# Altium project Voltage_Meter.PrjPCB
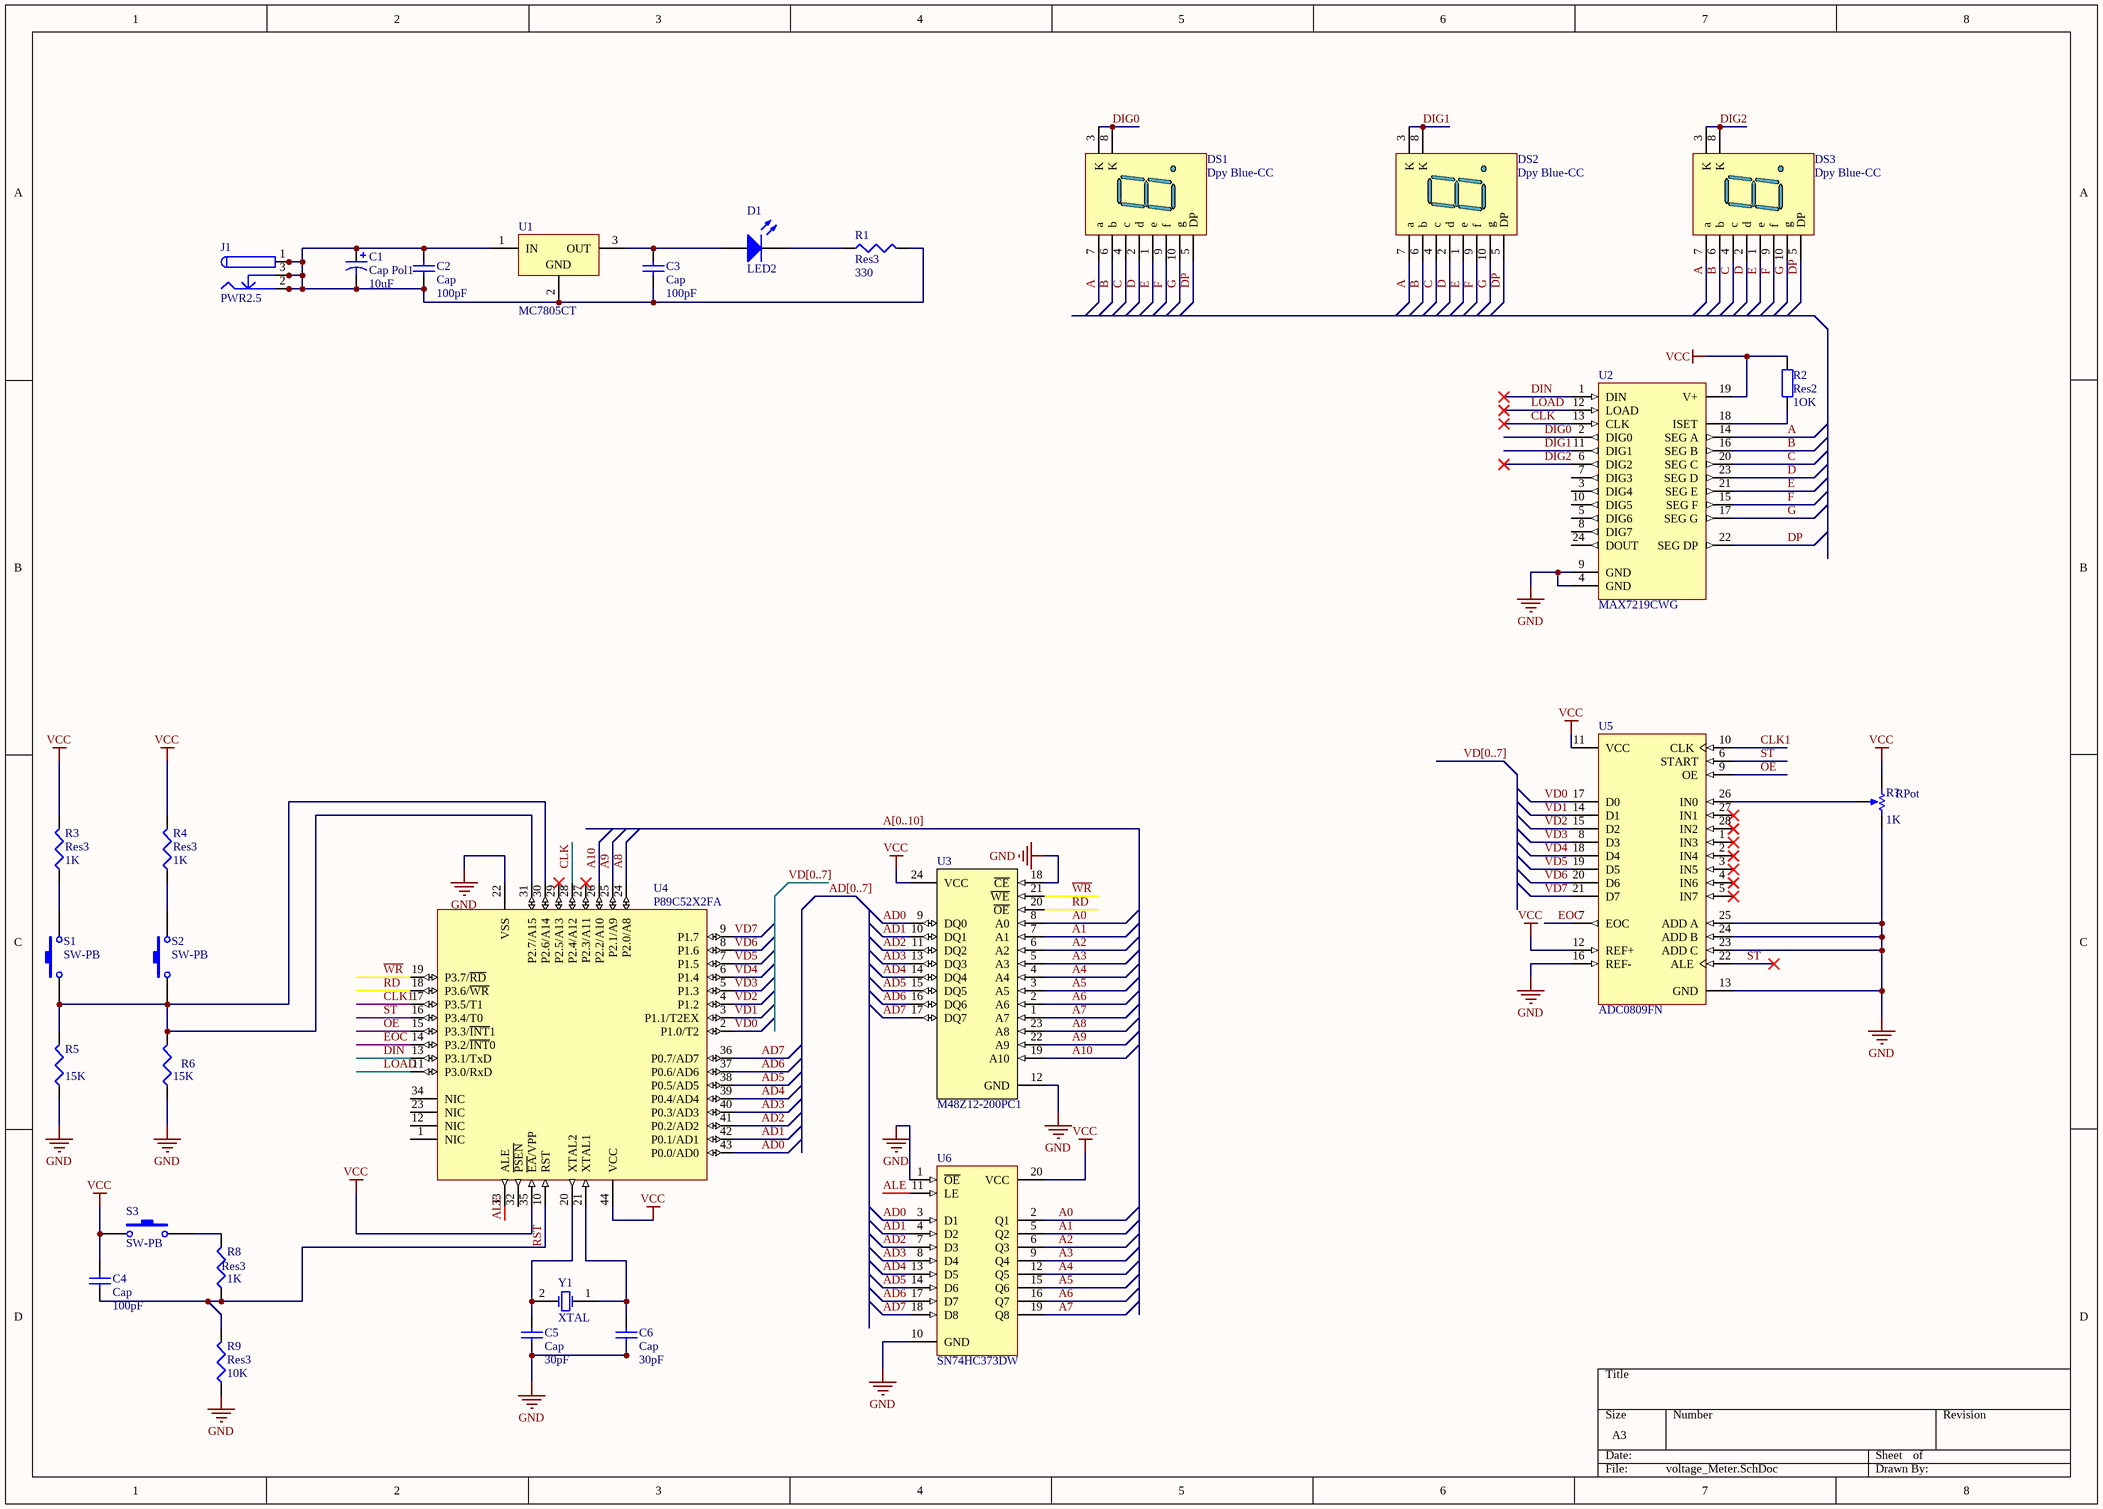
[diagram p0: voltage_Meter.SchDoc]
1 sheet, 30 parts. Net scope: global (net labels, ports and power ports of the same name join across sheets).

## Sheet voltage_Meter.SchDoc
size A3

### Parts
C1  Cap Pol1  value 10uF  [RB7.6-15]
C2  Cap  value 100pF  [RAD-0.3]
C3  Cap  value 100pF  [RAD-0.3]
C4  Cap  value 100pF  [RAD-0.3]
C5  Cap  value 30pF  [RAD-0.3]
C6  Cap  value 30pF  [RAD-0.3]
D1  LED2  [3.2X1.6X1.1]
DS1  Dpy Blue-CC  [H]
DS2  Dpy Blue-CC  [H]
DS3  Dpy Blue-CC  [H]
J1  PWR2.5  [KLD-0202]
R1  Res3  value 330  [J1-0603]
R2  Res2  value 1OK  [AXIAL-0.4]
R3  Res3  value 1K  [J1-0603]
R4  Res3  value 1K  [J1-0603]
R5  value 15K  [J1-0603]
R6  value 15K  [J1-0603]
R8  Res3  value 1K  [J1-0603]
R9  Res3  value 10K  [J1-0603]
R?  RPot  value 1K  [VR5]
S1  SW-PB  [SPST-2]
S2  SW-PB  [SPST-2]
S3  SW-PB  [SPST-2]
U1  MC7805CT  [221A-04]
U2  MAX7219CWG  [WSO24_N]
U3  M48Z12-200PC1  [PCDIP24]
U4  P89C52X2FA  [SOT187-2_N]
U5  ADC0809FN  [FN028_N]
U6  SN74HC373DW  [DW020_N]
Y1  XTAL  [R38]

### Nets
GND: C5.1 C6.1 R5.1 R6.1 R9.1 R?.2(BOT) U2.4(GND) U2.9(GND) U3.12(GND) U3.18(~{CE}) U4.22(VSS) U5.13(GND) U5.16(REF-) U5.23(ADD_C) U5.24(ADD_B) U5.25(ADD_A) U6.1(~{OE}) U6.10(GND)
VCC: C4.2 R2.2 R3.2 R4.2 R?.1(TOP) S3.1 U2.19(V+) U3.24(VCC) U4.35(~{EA}/VPP) U4.44(VCC) U5.11(VCC) U5.12(REF+) U6.20(VCC)
A: DS1.7(a) DS2.7(a) DS3.7(a) U2.14(SEG_A)
A0: U3.8(A0) U6.2(Q1)
A1: U3.7(A1) U6.5(Q2)
A2: U3.6(A2) U6.6(Q3)
A3: U3.5(A3) U6.9(Q4)
A4: U3.4(A4) U6.12(Q5)
A5: U3.3(A5) U6.15(Q6)
A6: U3.2(A6) U6.16(Q7)
A7: U3.1(A7) U6.19(Q8)
A8: U3.23(A8) U4.24(P2.0/A8)
A9: U3.22(A9) U4.25(P2.1/A9)
A10: U3.19(A10) U4.26(P2.2/A10)
AD0: U3.9(DQ0) U4.43(P0.0/AD0) U6.3(D1)
AD1: U3.10(DQ1) U4.42(P0.1/AD1) U6.4(D2)
AD2: U3.11(DQ2) U4.41(P0.2/AD2) U6.7(D3)
AD3: U3.13(DQ3) U4.40(P0.3/AD3) U6.8(D4)
AD4: U3.14(DQ4) U4.39(P0.4/AD4) U6.13(D5)
AD5: U3.15(DQ5) U4.38(P0.5/AD5) U6.14(D6)
AD6: U3.16(DQ6) U4.37(P0.6/AD6) U6.17(D7)
AD7: U3.17(DQ7) U4.36(P0.7/AD7) U6.18(D8)
ALE: U4.33(ALE) U6.11(LE)
B: DS1.6(b) DS2.6(b) DS3.6(b) U2.16(SEG_B)
C: DS1.4(c) DS2.4(c) DS3.4(c) U2.20(SEG_C)
CLK: U2.13(CLK) U4.28(P2.4/A12)
CLK1: U4.17(P3.5/T1) U5.10(CLK)
D: DS1.2(d) DS2.2(d) DS3.2(d) U2.23(SEG_D)
DIG0: DS1.3(K) DS1.8(K) U2.2(DIG0)
DIG1: DS2.3(K) DS2.8(K) U2.11(DIG1)
DIG2: DS3.3(K) DS3.8(K) U2.6(DIG2)
DIN: U2.1(DIN) U4.13(P3.1/TxD)
DP: DS1.5(DP) DS2.5(DP) DS3.5(DP) U2.22(SEG_DP)
E: DS1.1(e) DS2.1(e) DS3.1(e) U2.21(SEG_E)
EOC: U4.14(P3.2/~{INT}0) U5.7(EOC)
F: DS1.9(f) DS2.9(f) DS3.9(f) U2.15(SEG_F)
G: DS1.10(g) DS2.10(g) DS3.10(g) U2.17(SEG_G)
LOAD: U2.12(LOAD) U4.11(P3.0/RxD)
OE: U4.15(P3.3/~{INT}1) U5.9(OE)
RD: U3.20(~{OE}) U4.18(P3.6/~{WR})
RST: C4.1 R8.1 R9.2 U4.10(RST)
ST: U4.16(P3.4/T0) U5.6(START) U5.22(ALE)
VD0: U4.2(P1.0/T2) U5.17(D0)
VD1: U4.3(P1.1/T2EX) U5.14(D1)
VD2: U4.4(P1.2) U5.15(D2)
VD3: U4.5(P1.3) U5.8(D3)
VD4: U4.6(P1.4) U5.18(D4)
VD5: U4.7(P1.5) U5.19(D5)
VD6: U4.8(P1.6) U5.20(D6)
VD7: U4.9(P1.7) U5.21(D7)
~{WR}: U3.21(~{WE}) U4.19(P3.7/~{RD})
NetC1_1: C1.1 C1.2 C2.1 C2.2 C3.1 J1.1 J1.1A J1.1B J1.2 J1.2A J1.2B J1.3 J1.3A J1.3B R1.2 U1.1(IN) U1.2(GND)
NetC3_2: C3.2 D1.1(A) U1.3(OUT)
NetC5_2: C5.2 U4.20(XTAL2) Y1.2(OSC2)
NetC6_2: C6.2 U4.21(XTAL1) Y1.1(OSC1)
NetD1_2: D1.2(K) R1.1
NetR2_1: R2.1 U2.18(ISET)
NetR3_1: R3.1 S1.2
NetR4_1: R4.1 S2.2
NetR5_2: R5.2 R6.2 S1.1 S2.1 U4.30(P2.6/A14) U4.31(P2.7/A15)
NetR8_2: R8.2 S3.2
NetR?_3: R?.3(TAP) U5.26(IN0)

Not connected (* = marked no-connect by the designer): U2 3(DIG4) 5(DIG6) 7(DIG3) 8(DIG7) 10(DIG5) 24(DOUT); U4 1(NIC) 12(NIC) 23(NIC) 27(P2.3/A11)* 29(P2.5/A13)* 32(~{PSEN}) 34(NIC); U5 1(IN3)* 2(IN4)* 3(IN5)* 4(IN6)* 5(IN7)* 27(IN1)* 28(IN2)*

### Buses and harness runs
bus A[0..10]
bus AD[0..7]
bus VD[0..7]

### Library data of the parts
C1 = Cap Pol1: Polarized Capacitor (Radial); Published: 8-Jun-2000; LatestRevisionDate: 17-Jul-2002; LatestRevisionNote: Re-released for DXP Platform.; PackageReference: RB7.6-15; Publisher: Altium Limited; PackageDescription: Polarized Capacitor (Radial); 2 Leads
C2-C6 = Cap: Capacitor; Published: 8-Jun-2000; LatestRevisionDate: 17-Jul-2002; LatestRevisionNote: Re-released for DXP Platform.; PackageReference: RAD-0.3; Publisher: Altium Limited; PackageDescription: Radial Cap, Thru-Hole; 2 Leads; 0.3 in Pin Spacing
D1 = LED2: Typical RED, GREEN, YELLOW, AMBER GaAs LED; Published: 8-Jun-2000; LatestRevisionDate: 17-Jul-2002; LatestRevisionNote: Re-released for DXP Platform.; PackageVersion: Feb-2002; PackageReference: 3.2X1.6X1.1; Publisher: Altium Limited; PackageDescription: SM LED; 2 Flat Leads
DS1-DS3 = Dpy Blue-CC: 14.2 mm General Purpose Blue 7-Segment Display: CC, RH DP, Gray Surface; MinimumIntensity: 2020 ucd; Note: IF = 10 mA; Published: 8-Jun-2000; LatestRevisionDate: 17-Dec-2003; LatestRevisionNote: Schematic revised, PCB Footprint replaced.; DatasheetVersion: 24-Sep-2002; PackageVersion: 24-Sep-2002; PackageReference: H; Publisher: Altium Limited; PackageDescription: LED, 7-Segment Display, 14.2 mm, RHD; 10 Leads; Row Space 15.24 mm; Pitch 2.54 mm; Colour: Blue; ComponentLink1Description: Manufacturer Link; ComponentLink1URL: http://www.agilent.com/
J1 = PWR2.5: Low Voltage Power Supply Connector; Published: 17-Dec-2003; DatasheetDocument: 09-May-2002; Publisher: Altium Limited; ComponentLink1Description: Manufacturer Link; ComponentLink1URL: http://domino.kycon.com/internet/Products.html
R1 R3-R6 R8 R9 = Res3: Resistor; Published: 8-Jun-2000; LatestRevisionDate: 29-May-2009; LatestRevisionNote: IPC-7351 Footprint Added.; PackageReference: J1-0603; Publisher: Altium Limited; PackageDescription: Chip Resistor
R2 = Res2: Resistor; Published: 8-Jun-2000; LatestRevisionDate: 17-Jul-2002; LatestRevisionNote: Re-released for DXP Platform.; PackageReference: AXIAL-0.4; Publisher: Altium Limited; PackageDescription: Axial Device, Thru-Hole; 2 Leads; 0.4 in Pin Spacing
R? = RPot: Potentiometer; Sim Note: Enter the Resistance value and the set point into parameter fields.; Set Position: 0.5; Published: 8-Jun-2000; LatestRevisionDate: 17-Jul-2002; LatestRevisionNote: Re-released for DXP Platform.; PackageReference: VR5; Publisher: Altium Limited; PackageDescription: Variable Resistor, Thru-Hole; 3 Leads
S1-S3 = SW-PB: Switch; Published: 24-Mar-1999; LatestRevisionDate: 17-Jul-2002; LatestRevisionNote: Re-released for DXP Platform.; PackageReference: SPST-2; Publisher: Altium Limited; PackageDescription: Switch; 2 Leads
U1 = MC7805CT: 3-Terminal Positive Fixed Voltage Regulator; Note: Pin 2 is electrically connected to TAB; Published: 17-Jul-2002; DatasheetVersion: 1988; PackageReference: 221A-04; Publisher: Altium Limited; PackageDescription: TO, Thru-Hole, Vertical, Heatsink Mounted; 3 In-Line Leads; Pitch 2.54 mm; Code_JEDEC: TO-262-AA; ComponentLink1Description: Manufacturer Link; ComponentLink1URL: http://www.onsemi.com/site/products/taxonomy/0,4438,503,00.html; ComponentLink2Description: Datasheet; ComponentLink2URL: http://www.onsemi.com/pub/Collateral/MC7800-D.PDF
U2 = MAX7219CWG: Serially Interfaced, 8-Digit LED Display Driver; Published: 16-Jan-2001; LatestRevisionDate: 13-Apr-2006; LatestRevisionNote: IPC-7351 Footprint Added.; DatasheetVersion: Jul-1997; PackageReference: WSO24; Publisher: Altium Limited; PackageDescription: 24-Pin Small Outline Integrated Circuit 1.27 mm Pitch; ComponentLink1Description: Manufacturer Link; ComponentLink1URL: http://www.maxim-ic.com/; ComponentLink2Description: Datasheet; ComponentLink2URL: http://pdfserv.maxim-ic.com/en/ds/MAX7219-MAX7221.pdf
U3 = M48Z12-200PC1: 16 Kbit (2Kb x 8) Zeropower SRAM; Published: 24-Aug-2001; LatestRevisionDate: 17-Jul-2002; LatestRevisionNote: Re-released for DXP Platform.; DatasheetVersion: Jan-1998; PackageReference: PCDIP24; Publisher: Altium Limited; PackageDescription: DIP; 24 Rectangular Pins; Row Space 15.24 mm; Pitch 2.54 mm; ComponentLink1Description: Manufacturer Link; ComponentLink1URL: http://www.st.com/; ComponentLink2Description: Datasheet; ComponentLink2URL: http://www.st.com/stonline/products/literature/ds/2420/m48z02.pdf
U4 = P89C52X2FA: 80C51 8-Bit Flash Microcontroller Family, 8 kB Flash; Published: 21-May-2003; LatestRevisionDate: 13-Apr-2006; LatestRevisionNote: IPC-7351 Footprint Added.; DatasheetVersion: 5-Jun-2002; PackageVersion: Jan-2000; PackageReference: SOT187-2; Publisher: Altium Limited; PackageDescription: 44-Pin Leaded Chip Carrier 1.27 mm Pitch; Code_JEDEC: MO-047AC; Code_IPC: PLCC-44; ComponentLink1Description: Manufacturer Link; ComponentLink1URL: http://www-us2.semiconductors.philips.com/; ComponentLink2Description: Datasheet; ComponentLink2URL: http://www.semiconductors.philips.com/acrobat/datasheets/P89C5XX2_2.pdf
U5 = ADC0809FN: CMOS Analog-to-Digital Converter with 8-Channel Multiplexer; ComponentAvailability: Obsolete; Published: 15-Apr-2002; LatestRevisionDate: 13-Apr-2006; LatestRevisionNote: IPC-7351 Footprint Added.; DatasheetVersion: May-1988; PackageVersion: Oct-1994; PackageReference: FN028; Publisher: Altium Limited; PackageDescription: 28-Pin Leaded Chip Carrier 1.27 mm Pitch; Code_JEDEC: MS-018; Code_IPC: PLCC-28; ComponentLink1Description: Manufacturer Link; ComponentLink1URL: http://www.ti.com/
U6 = SN74HC373DW: Octal Transparent D-Type Latches with 3-State Outputs; Published: 8-Jun-2000; LatestRevisionDate: 13-Apr-2006; LatestRevisionNote: IPC-7351 Footprint Added.; DatasheetVersion: May-1997; PackageVersion: Mar-2000; PackageReference: DW020; Publisher: Altium Limited; PackageDescription: 20-Pin Plastic Small Outline Integrated Circuit 1.27 mm Pitch; Code_JEDEC: MS-013; Code_IPC: SOIC127P1030-20; ComponentLink1Description: Manufacturer Link; ComponentLink1URL: http://www.ti.com/; ComponentLink2Description: Datasheet; ComponentLink2URL: http://www-s.ti.com/sc/ds/sn54hc373.pdf
Y1 = XTAL: Crystal Oscillator; Published: 8-Jun-2000; LatestRevisionDate: 17-Jul-2002; LatestRevisionNote: Re-released for DXP Platform.; PackageReference: R38; Publisher: Altium Limited; PackageDescription: Crystal, Thru-Hole; 2 Leads; Body 3.1 x 8.2 mm (Dia.xH)